# Altium schematic sheet ecen201_main_schematic.SchDoc
size A4
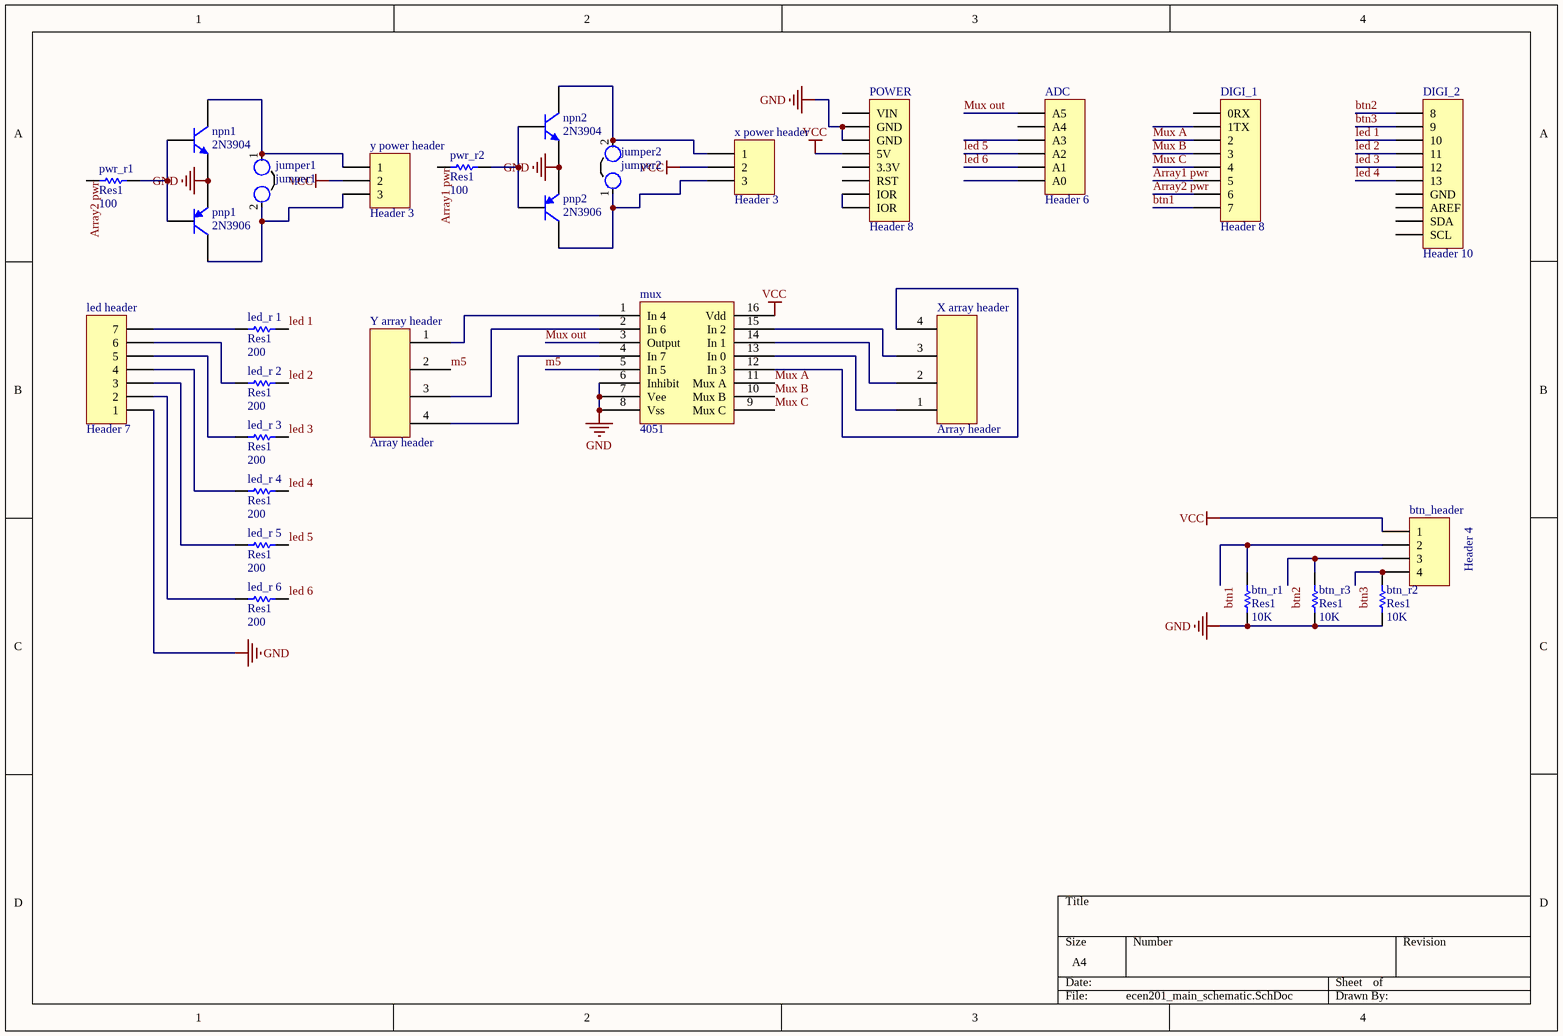
[diagram p0: ecen201_main_schematic.SchDoc]

## Parts
ADC  Header 6  [HDR1X6]
btn_header  Header 4  [HDR1X4]
btn_r1  Res1  value 10K  [AXIAL-0.3]
btn_r2  Res1  value 10K  [AXIAL-0.3]
btn_r3  Res1  value 10K  [AXIAL-0.3]
DIGI_1  Header 8  [HDR1X8]
DIGI_2  Header 10  [HDR1X10]
jumper1  jumper1  [jumper]
jumper2  jumper2  [jumper]
led_header  Header 7  [HDR1X7]
led_r_1  Res1  value 200  [AXIAL-0.3]
led_r_2  Res1  value 200  [AXIAL-0.3]
led_r_3  Res1  value 200  [AXIAL-0.3]
led_r_4  Res1  value 200  [AXIAL-0.3]
led_r_5  Res1  value 200  [AXIAL-0.3]
led_r_6  Res1  value 200  [AXIAL-0.3]
mux  4051  [4051]
npn1  2N3904  [TO-92A]
npn2  2N3904  [TO-92A]
pnp1  2N3906  [TO-92A]
pnp2  2N3906  [TO-92A]
POWER  Header 8  [HDR1X8]
pwr_r1  Res1  value 100  [AXIAL-0.3]
pwr_r2  Res1  value 100  [AXIAL-0.3]
X_array_header  Array header  [array header]
x_power_header  Header 3  [HDR1X3]
Y_array_header  Array header  [array header]
y_power_header  Header 3  [HDR1X3]

## Nets
GND: btn_r1.1 btn_r2.1 btn_r3.1 led_header.1 mux.6(Inhibit) mux.7(Vee) mux.8(Vss) npn1.1(E) npn2.1(E) pnp1.1(E) pnp2.1(E) POWER.2(GND) POWER.3(GND)
VCC: btn_header.1 mux.16(Vdd) POWER.4(5V) x_power_header.2 y_power_header.2
Array1 pwr: DIGI_1.6(5) pwr_r2.1
Array2 pwr: DIGI_1.7(6) pwr_r1.1
btn1: btn_header.2 btn_r1.2 DIGI_1.8(7)
btn2: btn_header.3 btn_r3.2 DIGI_2.1(8)
btn3: btn_header.4 btn_r2.2 DIGI_2.2(9)
led 1: DIGI_2.3(10) led_r_1.2
led 2: DIGI_2.4(11) led_r_2.2
led 3: DIGI_2.5(12) led_r_3.2
led 4: DIGI_2.6(13) led_r_4.2
led 5: ADC.4(A2) led_r_5.2
led 6: ADC.5(A1) led_r_6.2
m5: mux.5(In_5) Y_array_header.2
Mux A: DIGI_1.3(2) mux.11(Mux_A)
Mux B: DIGI_1.4(3) mux.10(Mux_B)
Mux C: DIGI_1.5(4) mux.9(Mux_C)
Mux out: ADC.1(A5) mux.3(Output)
Netjumper1_1: jumper1.1 npn1.3(C) y_power_header.1
Netjumper1_2: jumper1.2 pnp1.3(C) y_power_header.3
Netjumper2_1: jumper2.1 pnp2.3(C) x_power_header.3
Netjumper2_2: jumper2.2 npn2.3(C) x_power_header.1
Netled_header_2: led_header.2 led_r_6.1
Netled_header_3: led_header.3 led_r_5.1
Netled_header_4: led_header.4 led_r_4.1
Netled_header_5: led_header.5 led_r_3.1
Netled_header_6: led_header.6 led_r_2.1
Netled_header_7: led_header.7 led_r_1.1
Netmux_1: mux.1(In_4) Y_array_header.1
Netmux_2: mux.2(In_6) Y_array_header.3
Netmux_4: mux.4(In_7) Y_array_header.4
Netmux_12: mux.12(In_3) X_array_header.4
Netmux_13: mux.13(In_0) X_array_header.1
Netmux_14: mux.14(In_1) X_array_header.2
Netmux_15: mux.15(In_2) X_array_header.3
Netnpn1_2: npn1.2(B) pnp1.2(B) pwr_r1.2
Netnpn2_2: npn2.2(B) pnp2.2(B) pwr_r2.2
NetPOWER_7: POWER.7(IOR) POWER.8(IOR)

Not connected (* = marked no-connect by the designer): ADC 2(A4) 3(A3) 6(A0); DIGI_1 1(0RX) 2(1TX); DIGI_2 7(GND) 8(AREF) 9(SDA) 10(SCL); POWER 1(VIN) 5(3.3V) 6(RST)

## Library data of the parts
ADC = Header 6: Header, 6-Pin; LatestRevisionDate: 17-Jul-2002; LatestRevisionNote: Re-released for DXP Platform.; Publisher: Altium Limited
btn_header = Header 4: Header, 4-Pin; LatestRevisionDate: 17-Jul-2002; LatestRevisionNote: Re-released for DXP Platform.; Publisher: Altium Limited
btn_r1-btn_r3 led_r_1-led_r_6 pwr_r1 pwr_r2 = Res1: Resistor; Published: 8-Jun-2000; LatestRevisionDate: 17-Jul-2002; LatestRevisionNote: Re-released for DXP Platform.; PackageReference: AXIAL-0.3; Publisher: Altium Limited; PackageDescription: Axial Device, Thru-Hole; 2 Leads; 0.3 in Pin Spacing
DIGI_1 POWER = Header 8: Header, 8-Pin; LatestRevisionDate: 17-Jul-2002; LatestRevisionNote: Re-released for DXP Platform.; Publisher: Altium Limited
DIGI_2 = Header 10: Header, 10-Pin; LatestRevisionDate: 17-Jul-2002; LatestRevisionNote: Re-released for DXP Platform.; Publisher: Altium Limited
jumper1 jumper2 = jumper
led_header = Header 7: Header, 7-Pin; LatestRevisionDate: 17-Jul-2002; LatestRevisionNote: Re-released for DXP Platform.; Publisher: Altium Limited
npn1 npn2 = 2N3904: NPN General Purpose Amplifier; Published: 8-Jun-2000; LatestRevisionDate: 15-Jan-2003; LatestRevisionNote: PCB Footprint 'BCY-W3/D4.7' replaced; DatasheetVersion: 1997; PackageVersion: Sep-1998; PackageReference: TO-92A; Publisher: Altium Limited; PackageDescription: TO, Flat Index; 3 In-Line, Axial Leads; Body Dia. 4.5mm; Leads 0.51 x 0.48 mm (max); ComponentLink1Description: Manufacturer Link; ComponentLink1URL: http://www.fairchildsemi.com/; ComponentLink2Description: Datasheet; ComponentLink2URL: http://www.fairchildsemi.com/ds/2N%2F2N3904.pdf
pnp1 pnp2 = 2N3906: PNP General Purpose Amplifier; Published: 8-Jun-2000; LatestRevisionDate: 15-Jan-2003; LatestRevisionNote: PCB Footprint 'BCY-W3/D4.7' replaced; DatasheetVersion: 1997; PackageVersion: Sep-1998; PackageReference: TO-92A; Publisher: Altium Limited; PackageDescription: TO, Flat Index; 3 In-Line, Axial Leads; Body Dia. 4.5mm; Leads 0.51 x 0.48 mm (max); ComponentLink1Description: Manufacturer Link; ComponentLink1URL: http://www.fairchildsemi.com/; ComponentLink2Description: Datasheet; ComponentLink2URL: http://www.fairchildsemi.com/ds/2N%2F2N3906.pdf
x_power_header y_power_header = Header 3: Header, 3-Pin; LatestRevisionDate: 17-Jul-2002; LatestRevisionNote: Re-released for DXP Platform.; Publisher: Altium Limited